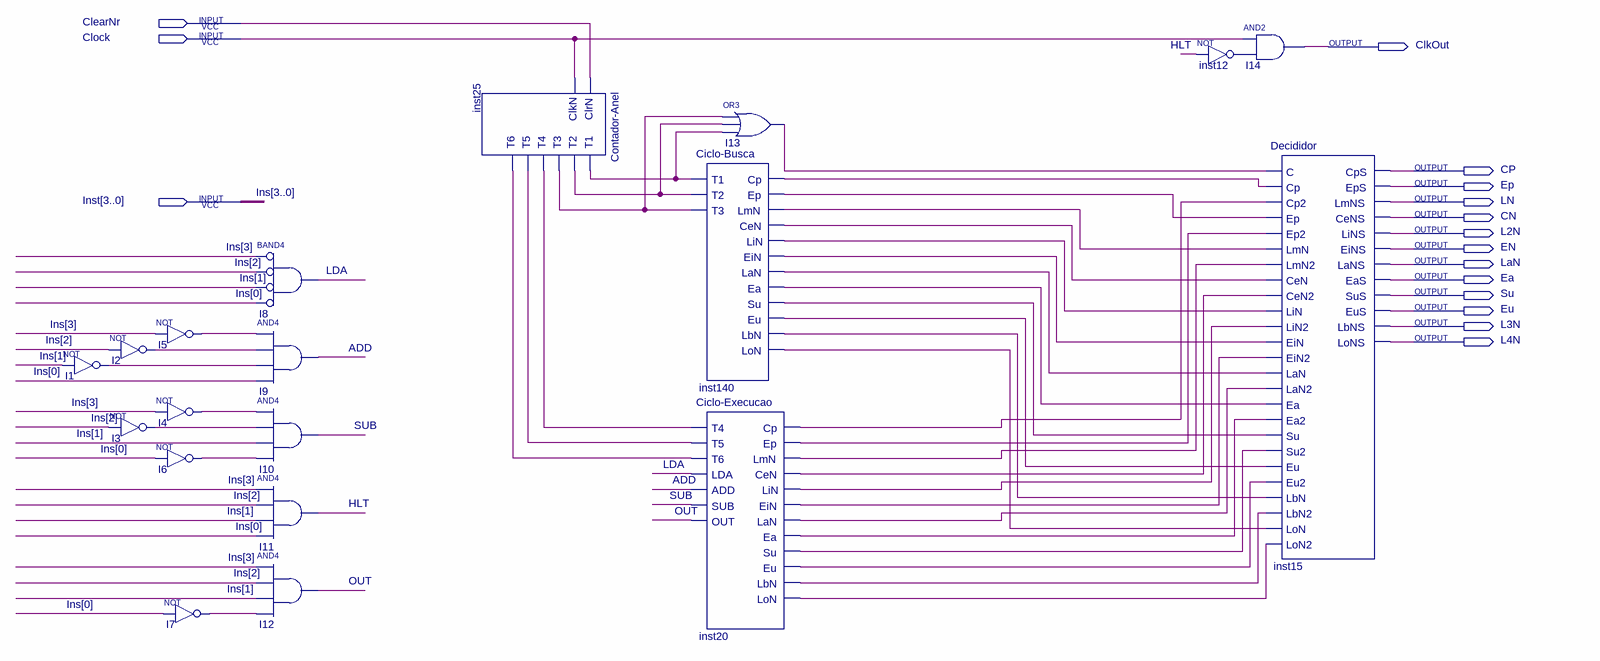
[diagram p0: schematic sheet]
// Quartus schematic Controlador.bdf as structural Verilog: 19 symbols, 16 pins
module Controlador (
  input  ClearNr,
  input  Clock,
  input  [3:0] Inst,
  output ClkOut,
  output CP,
  output Ep,
  output LN,
  output CN,
  output L2N,
  output EN,
  output LaN,
  output Ea,
  output Su,
  output Eu,
  output L3N,
  output L4N
);

  wire ADD, HLT, I1_out, I2_out, I3_out, I4_out, I5_out, I6_out, I7_out, I13_out, inst12_out, inst20_cen,
       inst20_cp, inst20_ea, inst20_ein, inst20_ep, inst20_eu, inst20_lan, inst20_lbn, inst20_lin,
       inst20_lmn, inst20_lon, inst20_su, inst25_t1, inst25_t2, inst25_t3, inst25_t4, inst25_t5, inst25_t6,
       inst140_cen, inst140_cp, inst140_ea, inst140_ein, inst140_ep, inst140_eu, inst140_lan, inst140_lbn,
       inst140_lin, inst140_lmn, inst140_lon, inst140_su, LDA, OUT, SUB;

  not I2 (I2_out, Inst[2]);
  not I1 (I1_out, Inst[1]);
  not I3 (I3_out, Inst[2]);
  not I5 (I5_out, Inst[3]);
  not I4 (I4_out, Inst[3]);
  not I6 (I6_out, Inst[0]);
  not I7 (I7_out, Inst[0]);
  and I8 (LDA, ~Inst[3], ~Inst[2], ~Inst[1], ~Inst[0]);  // BAND4
  and I9 (ADD, I5_out, I2_out, I1_out, Inst[0]);
  and I10 (SUB, I4_out, I3_out, Inst[1], I6_out);
  and I11 (HLT, Inst[3], Inst[2], Inst[1], Inst[0]);
  and I12 (OUT, Inst[3], Inst[2], Inst[1], I7_out);
  \Contador-Anel  inst25 (
    .ClrN(ClearNr), .ClkN(Clock), .T1(inst25_t1), .T2(inst25_t2), .T3(inst25_t3), .T4(inst25_t4),
    .T5(inst25_t5), .T6(inst25_t6));
  or I13 (I13_out, inst25_t3, inst25_t2, inst25_t1);
  \Ciclo-Busca  inst140 (
    .T1(inst25_t1), .T2(inst25_t2), .T3(inst25_t3), .Cp(inst140_cp), .Ep(inst140_ep), .LmN(inst140_lmn),
    .CeN(inst140_cen), .LiN(inst140_lin), .EiN(inst140_ein), .LaN(inst140_lan), .Ea(inst140_ea),
    .Su(inst140_su), .Eu(inst140_eu), .LbN(inst140_lbn), .LoN(inst140_lon));
  \Ciclo-Execucao  inst20 (
    .T4(inst25_t4), .T5(inst25_t5), .T6(inst25_t6), .LDA(LDA), .ADD(ADD), .SUB(SUB), .OUT(OUT),
    .Cp(inst20_cp), .Ep(inst20_ep), .LmN(inst20_lmn), .CeN(inst20_cen), .LiN(inst20_lin), .EiN(inst20_ein),
    .LaN(inst20_lan), .Ea(inst20_ea), .Su(inst20_su), .Eu(inst20_eu), .LbN(inst20_lbn), .LoN(inst20_lon));
  not inst12 (inst12_out, HLT);
  and I14 (ClkOut, Clock, inst12_out);
  Decididor inst15 (
    .C(I13_out), .Cp(inst140_cp), .Cp2(inst20_cp), .Ep(inst140_ep), .Ep2(inst20_ep), .LmN(inst140_lmn),
    .LmN2(inst20_lmn), .CeN(inst140_cen), .CeN2(inst20_cen), .LiN(inst140_lin), .LiN2(inst20_lin),
    .EiN(inst140_ein), .EiN2(inst20_ein), .LaN(inst140_lan), .LaN2(inst20_lan), .Ea(inst140_ea),
    .Ea2(inst20_ea), .Su(inst140_su), .Su2(inst20_su), .Eu(inst140_eu), .Eu2(inst20_eu), .LbN(inst140_lbn),
    .LbN2(inst20_lbn), .LoN(inst140_lon), .LoN2(inst20_lon), .CpS(CP), .EpS(Ep), .LmNS(LN), .CeNS(CN),
    .LiNS(L2N), .EiNS(EN), .LaNS(LaN), .EaS(Ea), .SuS(Su), .EuS(Eu), .LbNS(L3N), .LoNS(L4N));

  // Other names for the same wires on the sheet: Ins[3:0] = Inst
endmodule
